# EAGLE design ACwaveformMeter (EAGLE 8.3.2)
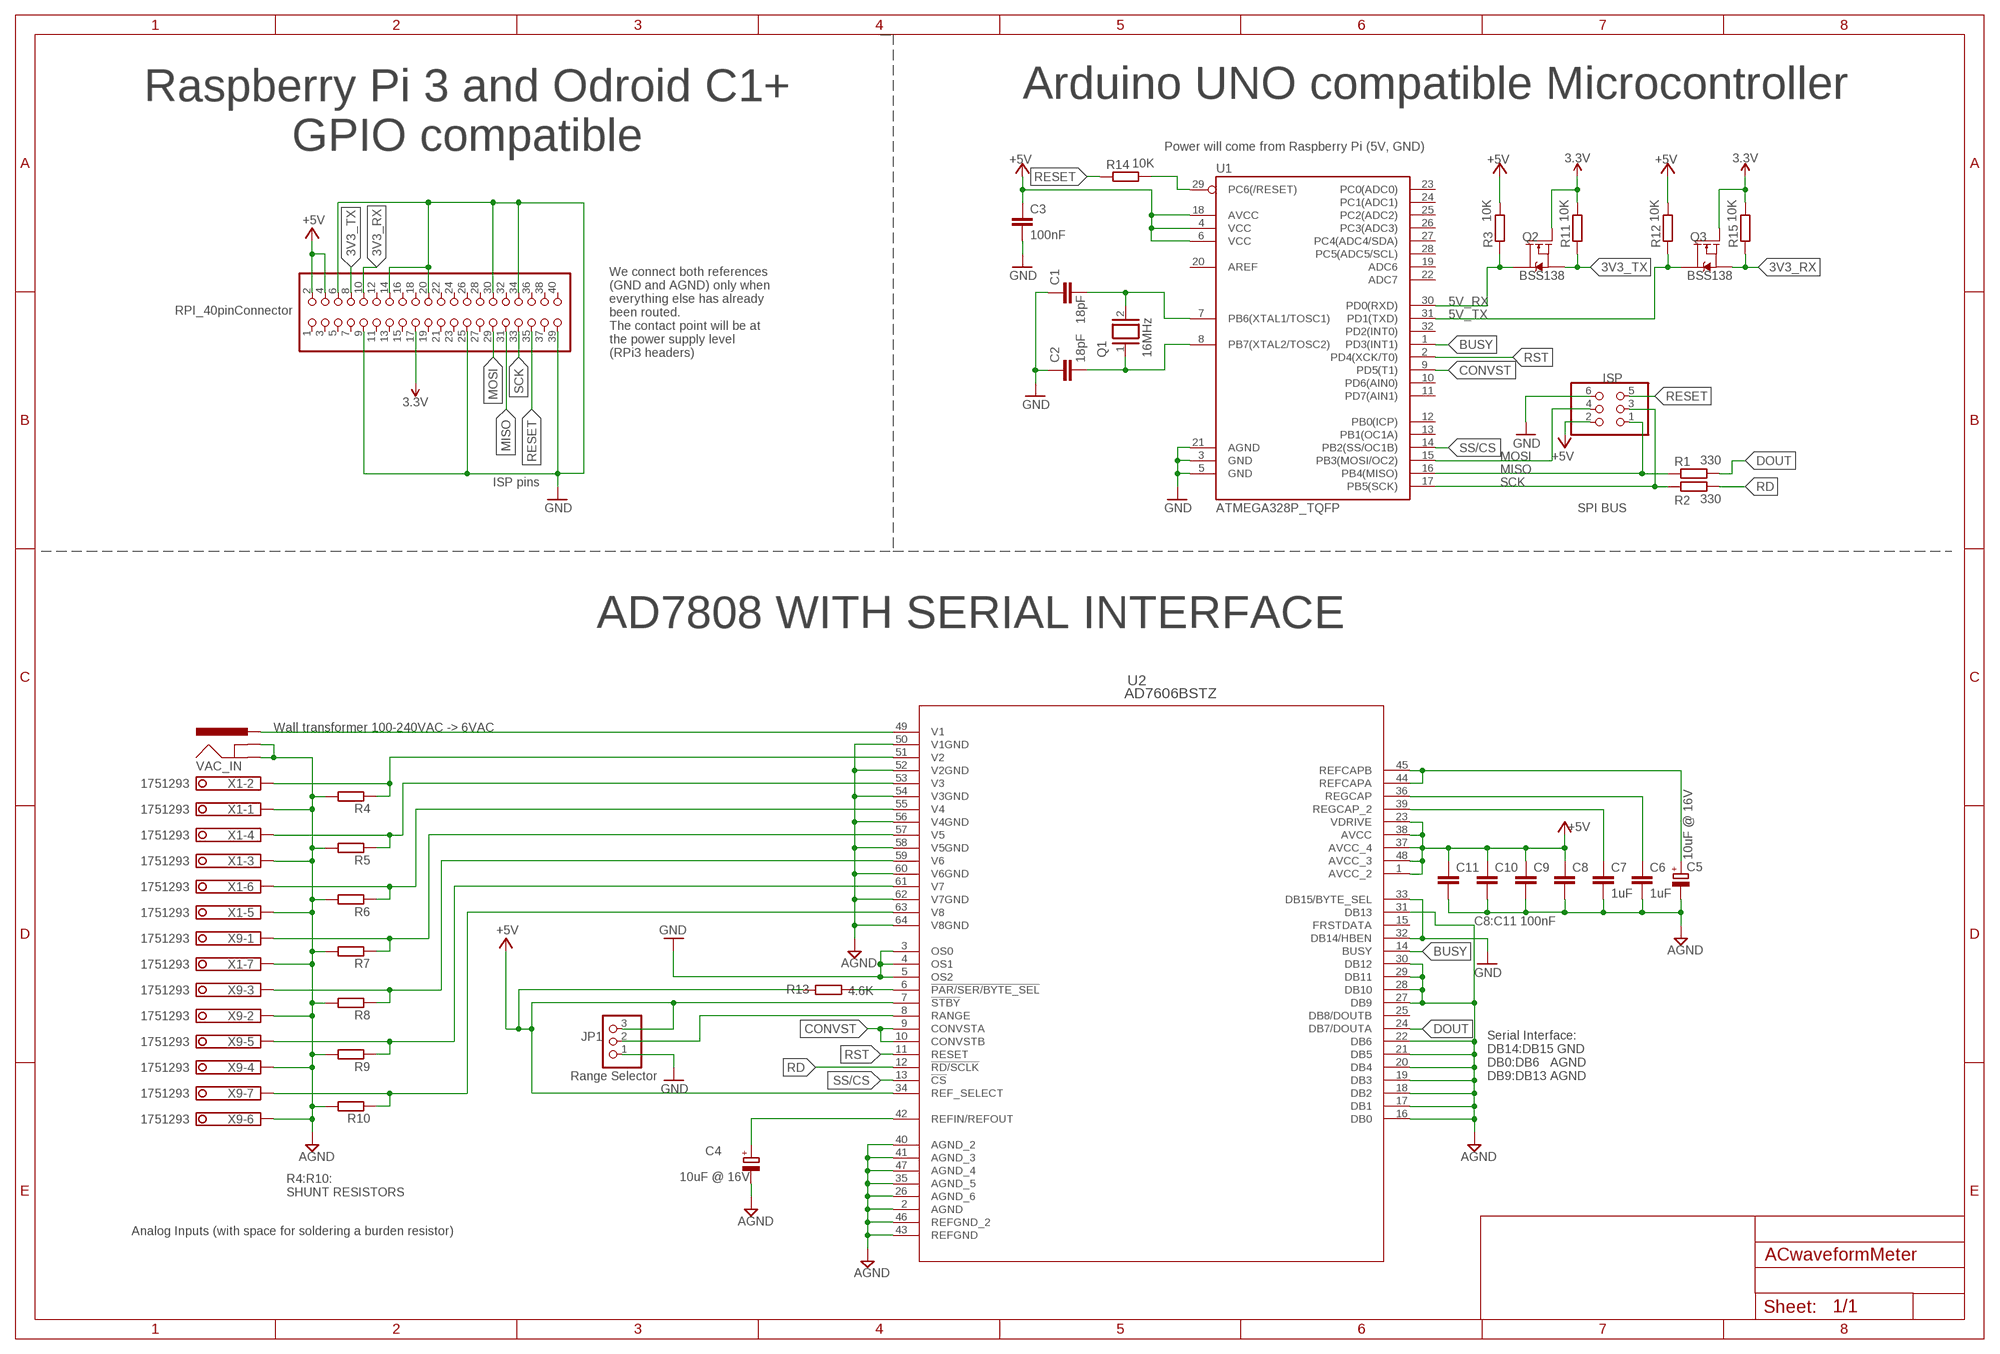
[diagram p0: schematic, sheet 1]

## Parts
C1  18pF  C-EUC0402  [C0402]
C2  18pF  C-EUC0402  [C0402]
C3  100nF  C-EUC0402  [C0402]
C4  10uF @ 16V  CPOL-EU153CLV-0405  [153CLV-0405]
C5  10uF @ 16V  CPOL-EU153CLV-0405  [153CLV-0405]
C6  1uF  C-EUC0402  [C0402]
C7  1uF  C-EUC0402  [C0402]
C8  100nF  C-EUC0402  [C0402]
C9  100nF  C-EUC0402  [C0402]
C10  100nF  C-EUC0402  [C0402]
C11  100nF  C-EUC0402  [C0402]
ISP  ISP6pin  PINHD-2X3  [2X03]
JP1  PINHD-1X3  [1X03]
Q1  16MHz  XTAL/S  [QS]
Q2  BSS138  MOSFET-NCH-BSS138  [SOT23-3]
Q3  BSS138  MOSFET-NCH-BSS138  [SOT23-3]
R1  330  R-EU_R0402  [R0402]
R2  330  R-EU_R0402  [R0402]
R3  10K  R-EU_R0402  [R0402]
R4  R-EU_M1206  [M1206]
R5  R-EU_M1206  [M1206]
R6  R-EU_M1206  [M1206]
R7  R-EU_M1206  [M1206]
R8  R-EU_M1206  [M1206]
R9  R-EU_M1206  [M1206]
R10  R-EU_M1206  [M1206]
R11  10K  R-EU_R0402  [R0402]
R12  10K  R-EU_R0402  [R0402]
R13  4.6K  R-EU_R0402  [R0402]
R14  10K  R-EU_R0402  [R0402]
R15  10K  R-EU_R0402  [R0402]
RASPBERRY_PI3  RPI_40pinConnector  PINHD-2X20  [2X20]
U1  ATMEGA328P_TQFP  [TQFP32-08]
U2  AD7606BSTZ  [ST_64_2]
VAC_IN  POWER_JACKPTH_LOCK  [POWER_JACK_PTH_LOCK]
X1  1751293  [1751293]
X9  1751293  [1751293]

## Nets
3.3V: Q2.1(G) Q3.1(G) R11.2 R15.2 RASPBERRY_PI3.17
3V3_RX: Q3.2(S) R15.1 RASPBERRY_PI3.10
3V3_TX: Q2.2(S) R11.1 RASPBERRY_PI3.8
5V_RX: Q2.3(D) R3.1 U1.30(PD0(RXD))
5V_TX: Q3.3(D) R12.1 U1.31(PD1(TXD))
+5V: C3.1 C8.1 C9.1 C10.1 C11.1 ISP.2 JP1.3 R3.2 R12.2 R13.1 RASPBERRY_PI3.2 RASPBERRY_PI3.4 U1.4(VCC) U1.6(VCC) U1.18(AVCC) U2.1(AVCC_2) U2.7(!STBY) U2.23(VDRIVE) U2.34(REF_SELECT) U2.37(AVCC_4) U2.38(AVCC) U2.48(AVCC_3)
BUSY: U1.1(PD3(INT1)) U2.14(BUSY)
CONVST: U1.9(PD5(T1)) U2.9(CONVSTA) U2.10(CONVSTB)
DOUT: R1.2 U2.24(DB7/DOUTA)
GND: C1.1 C2.1 C3.2 C4.- C5.- C6.2 C7.2 C8.2 C9.2 C10.2 C11.2 ISP.6 JP1.1 R4.2 R5.2 R6.2 R7.2 R8.2 R9.2 R10.2 RASPBERRY_PI3.6 RASPBERRY_PI3.9 RASPBERRY_PI3.14 RASPBERRY_PI3.20 RASPBERRY_PI3.25 RASPBERRY_PI3.30 RASPBERRY_PI3.34 RASPBERRY_PI3.39 U1.3(GND) U1.5(GND) U1.21(AGND) U2.2(AGND) U2.3(OS0) U2.4(OS1) U2.5(OS2) U2.16(DB0) U2.17(DB1) U2.18(DB2) U2.19(DB3) U2.20(DB4) U2.21(DB5) U2.22(DB6) U2.26(AGND_6) U2.27(DB9) U2.28(DB10) U2.29(DB11) U2.30(DB12) U2.31(DB13) U2.32(DB14/HBEN) U2.33(DB15/BYTE_SEL) U2.35(AGND_5) U2.40(AGND_2) U2.41(AGND_3) U2.43(REFGND) U2.46(REFGND_2) U2.47(AGND_4) U2.50(V1GND) U2.52(V2GND) U2.54(V3GND) U2.56(V4GND) U2.58(V5GND) U2.60(V6GND) U2.62(V7GND) U2.64(V8GND) VAC_IN.GND VAC_IN.GNDBREAK X1.1 X1.3 X1.5 X1.7 X9.2 X9.4 X9.6 ; supply symbol labelled AGND
MISO: ISP.1 R1.1 RASPBERRY_PI3.31 U1.16(PB4(MISO))
MOSI: ISP.4 RASPBERRY_PI3.29 U1.15(PB3(MOSI/OC2))
N$1: C5.+ U2.44(REFCAPA) U2.45(REFCAPB)
N$2: C4.+ U2.42(REFIN/REFOUT)
N$3: U2.49(V1) VAC_IN.PWR
N$4: C6.1 U2.36(REGCAP)
N$5: C7.1 U2.39(REGCAP_2)
N$6: C1.2 Q1.2 U1.7(PB6(XTAL1/TOSC1))
N$7: C2.2 Q1.1 U1.8(PB7(XTAL2/TOSC2))
N$8: R14.2 U1.29(PC6(/RESET))
N$9: JP1.2 U2.8(RANGE)
N$12: R13.2 U2.6(!PAR/SER/BYTE_SEL)
N$23: R4.1 U2.51(V2) X1.2
N$24: R5.1 U2.53(V3) X1.4
N$25: R6.1 U2.55(V4) X1.6
N$26: R7.1 U2.57(V5) X9.1
N$27: R8.1 U2.59(V6) X9.3
N$28: R9.1 U2.61(V7) X9.5
N$29: R10.1 U2.63(V8) X9.7
RD: R2.2 U2.12(!RD/SCLK)
RESET: ISP.5 R14.1 RASPBERRY_PI3.35
RST: U1.2(PD4(XCK/T0)) U2.11(RESET)
SCK: ISP.3 R2.1 RASPBERRY_PI3.33 U1.17(PB5(SCK))
SS/CS: U1.14(PB2(SS/OC1B)) U2.13(!CS)
Unconnected: RASPBERRY_PI3.1 RASPBERRY_PI3.3 RASPBERRY_PI3.5 RASPBERRY_PI3.7 RASPBERRY_PI3.11 RASPBERRY_PI3.12 RASPBERRY_PI3.13 RASPBERRY_PI3.15 RASPBERRY_PI3.16 RASPBERRY_PI3.18 RASPBERRY_PI3.19 RASPBERRY_PI3.21 RASPBERRY_PI3.22 RASPBERRY_PI3.23 RASPBERRY_PI3.24 RASPBERRY_PI3.26 RASPBERRY_PI3.27 RASPBERRY_PI3.28 RASPBERRY_PI3.32 RASPBERRY_PI3.36 RASPBERRY_PI3.37 RASPBERRY_PI3.38 RASPBERRY_PI3.40 U1.10(PD6(AIN0)) U1.11(PD7(AIN1)) U1.12(PB0(ICP)) U1.13(PB1(OC1A)) U1.19(ADC6) U1.20(AREF) U1.22(ADC7) U1.23(PC0(ADC0)) U1.24(PC1(ADC1)) U1.25(PC2(ADC2)) U1.26(PC3(ADC3)) U1.27(PC4(ADC4/SDA)) U1.28(PC5(ADC5/SCL)) U1.32(PD2(INT0)) U2.15(FRSTDATA) U2.25(DB8/DOUTB)

## Notes on the sheet
- Arduino UNO compatible Microcontroller
- Raspberry Pi 3 and Odroid C1+
  GPIO compatible
- Power will come from Raspberry Pi (5V, GND)
- We connect both references 
  (GND and AGND) only when 
  everything else has already 
  been routed. 
  The contact point will be at 
  the power supply level
  (RPi3 headers)
- ISP pins
- SPI BUS
- AD7808 WITH SERIAL INTERFACE
- Wall transformer 100-240VAC -> 6VAC
- C8:C11 100nF
- Range Selector
- Serial Interface: 
  DB14:DB15 GND
  DB0:DB6   AGND
  DB9:DB13 AGND
- R4:R10:
  SHUNT RESISTORS
- Analog Inputs (with space for soldering a burden resistor)

## Library data of the parts
C1-C3 C6-C11 = rcl:C-EU: CAPACITOR, European symbol
C4 C5 = rcl:CPOL-EU: POLARIZED CAPACITOR, European symbol
ISP = pinhead:PINHD-2X3: PIN HEADER
JP1 = pinhead:PINHD-1X3: PIN HEADER
Q1 = special:XTAL/S: CRYSTAL
Q2 Q3 = SparkFun-DiscreteSemi:MOSFET-NCH: N-channel MOSFETs Voltage controlled devices that allow control of high current outputs. SparkFun Products: SparkFun OpenScale <https://www.sparkfun.com/products/13261> SparkFun Digital Sandbox <https://www.sparkfun.com/products/12651> SparkFun Monster Moto Shield <https://www.sparkfun.com/products/10182> SparkFun MOSFET Power Controller <https://www.sparkfun.com/products/11214>; PROD_ID: TRANS-00830; VALUE: 220mA/50V/3.5Ω
R1-R15 = rcl:R-EU_: RESISTOR, European symbol
RASPBERRY_PI3 = pinhead:PINHD-2X20: PIN HEADER
U1 = SparkFun-IC-Microcontroller:ATMEGA328P_TQFP: Popular 328P in QFP Storefront component: ATmega328 - TQFP <https://www.sparkfun.com/products/13448> (COM-13448) Datasheet <http://www.sparkfun.com/datasheets/Components/SMD/ATMega328.pdf> SparkFun Products SparkFun RedBoard - Programmed with Arduino <https://www.sparkfun.com/products/12757> (DEV-12757) Arduino Pro Mini 328 - 5V/16MHz <https://www.sparkfun.com/products/11113> (DEV-11113) Arduino Pro Mini 328 - 3.3V/8MHz <https://www.sparkfun.com/products/11114> (DEV-11114) SparkFun OpenLog <https://www.sparkfun.com/products/13712> (DEV-13712) SparkFun MicroView - OLED Arduino Module <https://www.sparkfun.com/products/12923> (DEV-12923) SparkFun Digital Sandbox <https://www.sparkfun.com/products/12651> (DEV-12651) SparkFun PicoBoard <https://www.sparkfun.com/products/11888> (WIG-11888) Arduino Fio <https://www.sparkfun.com/products/10116> (DEV-10116) LilyPad Arduino 328 Main Board <https://www.sparkfun.com/products/13342> (DEV-13342) SparkFun RedStick <https://www.sparkfun.com/products/13741> (DEV-13741) LilyPad MP3 <https://www.sparkfun.com/products/11013> (DEV-11013) LilyPad Arduino SimpleSnap <https://www.sparkfun.com/products/10941> (DEV-10941) SparkFun Stepoko <https://www.sparkfun.com/products/13899> (ROB-13899) SparkFun Geiger Counter <https://www.sparkfun.com/products/11345> (SEN-11345) SparkFun EL Sequencer <https://www.sparkfun.com/products/12781> (COM-12781) Arduino Pro 328 - 5V/16MHz <https://www.sparkfun.com/products/10915> (DEV-10915) CryptoCape <https://www.sparkfun.com/products/12773> (DEV-12773) SparkFun IR Thermometer Evaluation Board - MLX90614 <https://www.sparkfun.com/products/10740> (SEN-10740) SparkFun RedBot Mainboard <https://www.sparkfun.com/products/12097> (ROB-12097) Arduino Pro 328 - 3.3V/8MHz <https://www.sparkfun.com/products/10914> (DEV-10914) SparkFun Block for Intel® Edison - Arduino <https://www.sparkfun.com/products/13036> (DEV-13036) SparkFun Simon Says - Surface Mount Soldering Kit <https://www.sparkfun.com/products/10935> (KIT-10935) SparkFun 7-Segment Serial Display - Red <https://www.sparkfun.com/products/11441> (COM-11441) SparkFun 7-Segment Serial Display - White <https://www.sparkfun.com/products/11629> (COM-11629) SparkFun 7-Segment Serial Display - Yellow <https://www.sparkfun.com/products/11443> (COM-11443) SparkFun 7-Segment Serial Display - Kelly Green <https://www.sparkfun.com/products/11440> (COM-11440) SparkFun 7-Segment Serial Display - Blue <https://www.sparkfun.com/products/11442> (COM-11442) SparkFun OpenSegment Serial Display - 20mm (Blue) <https://www.sparkfun.com/products/11647> (COM-11647) SparkFun OpenSegment Serial Display - 20mm (Green) <https://www.sparkfun.com/products/11646> (COM-11646) SparkFun OpenSegment Serial Display - 20mm (White) <https://www.sparkfun.com/products/11648> (COM-11648) SparkFun OpenSegment Serial Display - 20mm (Red) <https://www.sparkfun.com/products/11644> (COM-11644) SparkFun OpenSegment Serial Display - 20mm (Yellow) <https://www.sparkfun.com/products/11645> (COM-11645) SparkFun OpenSegment Shield <https://www.sparkfun.com/products/13190> (DEV-13190); PROD_ID: IC-09069
U2 = AD7606:AD7606BSTZ
VAC_IN = SparkFun-Connectors:POWER_JACK: Power Jack Connector This is the standard 5.5mm barrel jack for power. The PTH is the most common, proven, reliable, footprint. The Slot footprint only works if the mill layer is transmitted to the PCB fab house so be warned. Here are the connectors we sell at SparkFun: DC Barrel Power Jack/Connector <https://www.sparkfun.com/products/119> (PRT-00119) DC Barrel Power Jack/Connector (SMD) <https://www.sparkfun.com/products/12748> (PRT-12748) DC Barrel Jack Adapter - Breadboard Compatible <https://www.sparkfun.com/products/10811> (PRT-10811) It is used on this SparkFun product (and many, many others): SparkFun RedBoard - Programmed with Arduino <https://www.sparkfun.com/products/12757> (DEV-12757) Also, if you need a mating power supply or connector, please check these out: Wall Adapter Power Supply - 9VDC 650mA <https://www.sparkfun.com/products/298> (TOL-00298) DC Barrel Jack Adapter - Male <https://www.sparkfun.com/products/10287> (PRT-10287); PROD_ID: CONN-08197; SF_ID: PRT-00119
X1 X9 = con-phoenix-350:1751293: MKDS 1/ 7-3,5 Printklemme Nennstrom: 10 A Bemessungsspannung: 160 V Raster: 3,5 mm Polzahl: 7 Montageart: Löten Anschlussart: Schraubanschluss Anschlussrichtung vom Leiter zur Platine: 0° Source: http://eshop.phoenixcontact.com .. 1751293.pdf; OC_FARNELL: unknown; OC_NEWARK: unknown

## Board
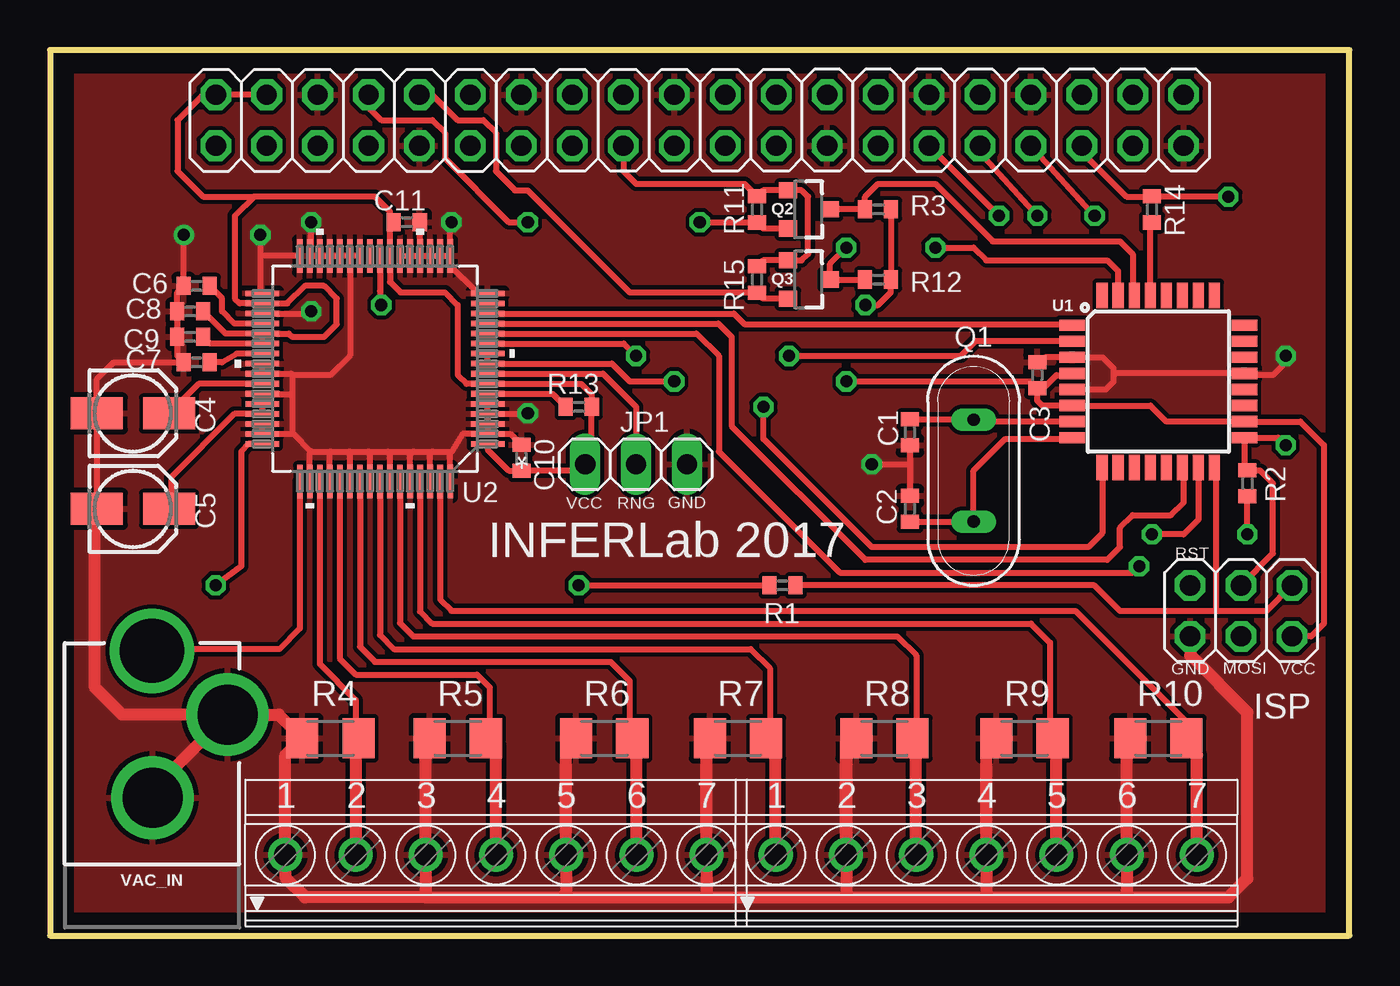
[diagram p1: board, top side]
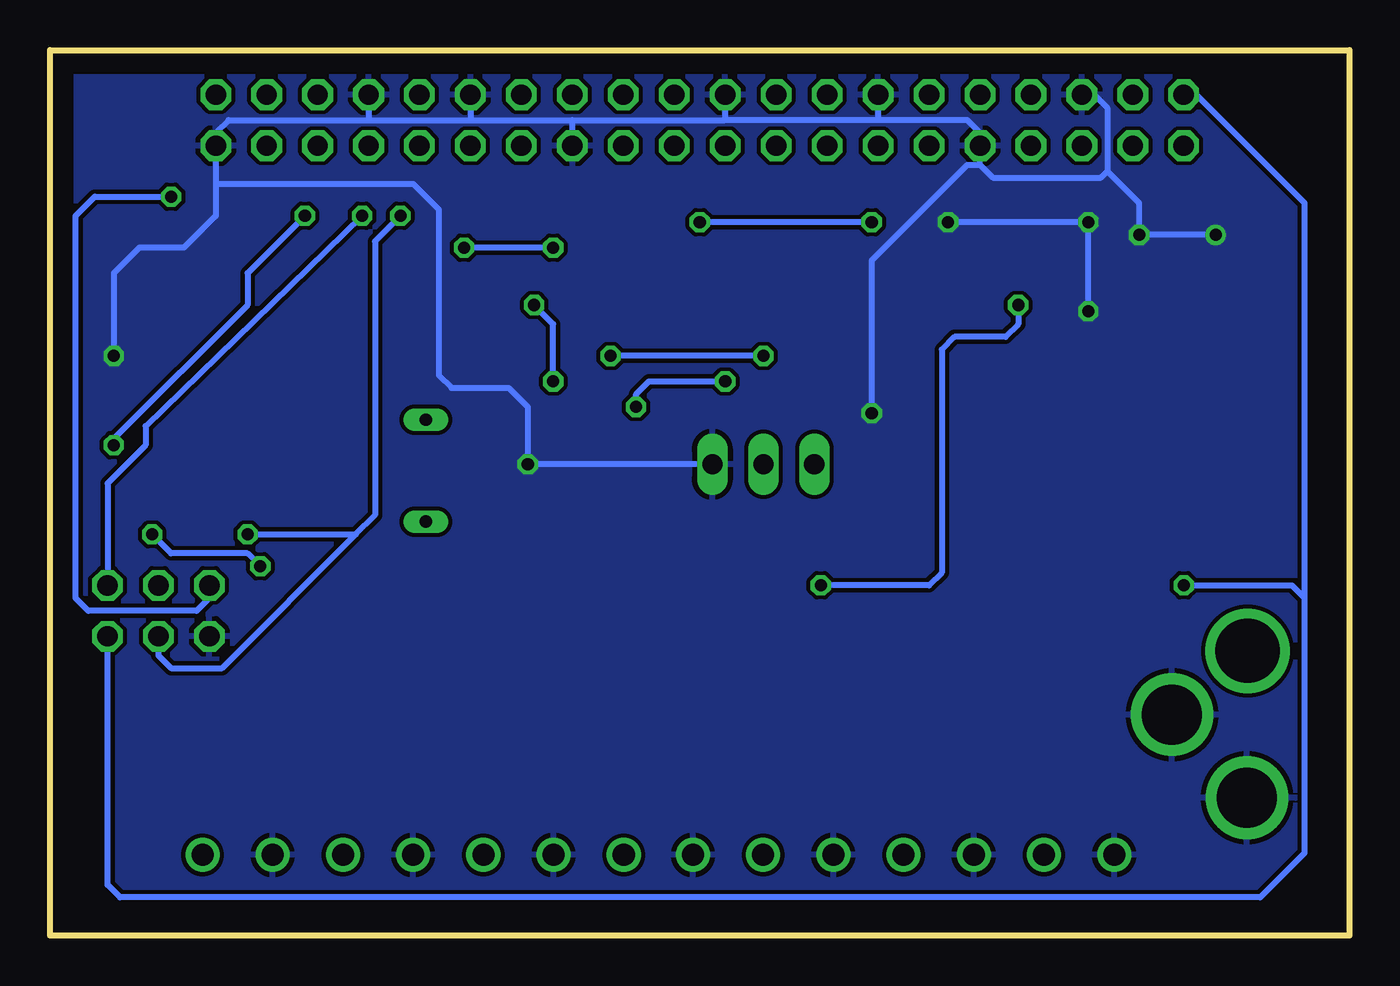
[diagram p2: board, bottom side, seen from below]

Size 64.77 x 44.13 mm. Coordinates in mm from the lower left corner, seen from the top.
Outline: 0,0 64.77,0 64.77,44.13 0,44.13 0,0
Copper layers (1*16): Top 0.035mm / dielectric 1.5mm / Bottom 0.035mm
Design rules "default *": minimum track width 10mil, minimum drill 24mil, track to track 8mil, track to pad 15mil, pad to pad 8mil, via to via 8mil, smd to smd 8mil, copper to edge 40mil, drill to drill 8mil, minimum pad ring 10mil, minimum via ring 8mil, stop-mask expansion 4mil, vias tented up to drill 0mil, thermal gap 10mil

### Footprints (pad centres in the part's own frame; a part is rotated, then mirrored left to right if it is on the bottom)
C0402 = smd 0.7 x 0.9: 1 -0.65,0; 2 0.65,0
153CLV-0405 = smd 2.6 x 1.6: + 1.8,0; - -1.8,0
2X03 = drill 1.016 octagon: 1 -2.54,-1.27; 2 -2.54,1.27; 3 0,-1.27; 4 0,1.27; 5 2.54,-1.27; 6 2.54,1.27
1X03 = drill 1.016 long: 1 -2.54,0; 2 0,0; 3 2.54,0
QS = drill 0.61 long: 1 -2.54,0; 2 2.54,0
SOT23-3 = smd 0.8 x 0.9: 1 -0.95,-1; 2 0.95,-1; 3 0,1.1
R0402 = smd 0.7 x 0.9: 1 -0.65,0; 2 0.65,0
M1206 = smd 1.6 x 2: 1 -1.4,0; 2 1.4,0
2X20 = drill 1.016 octagon: 1 -24.13,-1.27; 2 -24.13,1.27; 3 -21.59,-1.27; 4 -21.59,1.27; 5 -19.05,-1.27; 6 -19.05,1.27; 7 -16.51,-1.27; 8 -16.51,1.27; 9 -13.97,-1.27; 10 -13.97,1.27; 11 -11.43,-1.27; 12 -11.43,1.27; 13 -8.89,-1.27; 14 -8.89,1.27; 15 -6.35,-1.27; 16 -6.35,1.27; 17 -3.81,-1.27; 18 -3.81,1.27; 19 -1.27,-1.27; 20 -1.27,1.27; 21 1.27,-1.27; 22 1.27,1.27; 23 3.81,-1.27; 24 3.81,1.27; 25 6.35,-1.27; 26 6.35,1.27; 27 8.89,-1.27; 28 8.89,1.27; 29 11.43,-1.27; 30 11.43,1.27; 31 13.97,-1.27; 32 13.97,1.27; 33 16.51,-1.27; 34 16.51,1.27; 35 19.05,-1.27; 36 19.05,1.27; 37 21.59,-1.27; 38 21.59,1.27; 39 24.13,-1.27; 40 24.13,1.27
TQFP32-08 = smd 1.27 x 0.559: 1 -4.293,2.8; 2 -4.293,2; 3 -4.293,1.2; 4 -4.293,0.4; 5 -4.293,-0.4; 6 -4.293,-1.2; 7 -4.293,-2; 8 -4.293,-2.8; 17 4.293,-2.8; 18 4.293,-2; 19 4.293,-1.2; 20 4.293,-0.4; 21 4.293,0.4; 22 4.293,1.2; 23 4.293,2; 24 4.293,2.8 | smd 0.559 x 1.27: 9 -2.8,-4.293; 10 -2,-4.293; 11 -1.2,-4.293; 12 -0.4,-4.293; 13 0.4,-4.293; 14 1.2,-4.293; 15 2,-4.293; 16 2.8,-4.293; 25 2.8,4.293; 26 2,4.293; 27 1.2,4.293; 28 0.4,4.293; 29 -0.4,4.293; 30 -1.2,4.293; 31 -2,4.293; 32 -2.8,4.293
ST_64_2 = smd 1.664 x 0.279: 1 -5.62,3.75; 2 -5.62,3.25; 3 -5.62,2.75; 4 -5.62,2.25; 5 -5.62,1.75; 6 -5.62,1.25; 7 -5.62,0.75; 8 -5.62,0.25; 9 -5.62,-0.25; 10 -5.62,-0.75; 11 -5.62,-1.25; 12 -5.62,-1.75; 13 -5.62,-2.25; 14 -5.62,-2.75; 15 -5.62,-3.25; 16 -5.62,-3.75; 33 5.62,-3.75; 34 5.62,-3.25; 35 5.62,-2.75; 36 5.62,-2.25; 37 5.62,-1.75; 38 5.62,-1.25; 39 5.62,-0.75; 40 5.62,-0.25; 41 5.62,0.25; 42 5.62,0.75; 43 5.62,1.25; 44 5.62,1.75; 45 5.62,2.25; 46 5.62,2.75; 47 5.62,3.25; 48 5.62,3.75 | smd 0.279 x 1.664: 17 -3.75,-5.62; 18 -3.25,-5.62; 19 -2.75,-5.62; 20 -2.25,-5.62; 21 -1.75,-5.62; 22 -1.25,-5.62; 23 -0.75,-5.62; 24 -0.25,-5.62; 25 0.25,-5.62; 26 0.75,-5.62; 27 1.25,-5.62; 28 1.75,-5.62; 29 2.25,-5.62; 30 2.75,-5.62; 31 3.25,-5.62; 32 3.75,-5.62; 49 3.75,5.62; 50 3.25,5.62; 51 2.75,5.62; 52 2.25,5.62; 53 1.75,5.62; 54 1.25,5.62; 55 0.75,5.62; 56 0.25,5.62; 57 -0.25,5.62; 58 -0.75,5.62; 59 -1.25,5.62; 60 -1.75,5.62; 61 -2.25,5.62; 62 -2.75,5.62; 63 -3.25,5.62; 64 -3.75,5.62
POWER_JACK_PTH_LOCK = drill 2.997 pad 4.115: GND 0.025,6.557; GNDBREAK 3.762,10.7 | drill 3.2 pad 4.115: PWR 0,13.878
1751293 = drill 1.1 pad 1.7: 1 -10.5,-0.1; 2 -7,-0.1; 3 -3.5,-0.1; 4 0,-0.1; 5 3.5,-0.1; 6 7,-0.1; 7 10.5,-0.1

### Placement (x,y rotation side)
C1  42.86,25.08 90 top
C2  42.86,21.27 270 top
C3  49.21,27.94 90 top
C4  4.13,26.04 0 top
C5  4.13,21.27 0 top
C6  7.3,32.38 180 top
C7  7.3,28.57 180 top
C8  6.99,31.11 180 top
C9  6.99,29.84 180 top
C10  23.5,23.81 90 top
C11  17.78,35.56 0 top
ISP  59.37,16.19 180 top
JP1  29.21,23.5 180 top
Q1  46.04,23.18 90 top
Q2  37.78,36.2 270 top
Q3  37.78,32.7 270 top
R1  36.51,17.46 180 top
R2  59.69,22.54 270 top
R3  41.27,36.2 0 top
R4  13.97,9.84 180 top
R5  20.32,9.84 180 top
R6  27.62,9.84 180 top
R7  34.29,9.84 180 top
R8  41.59,9.84 180 top
R9  48.58,9.84 180 top
R10  55.24,9.84 180 top
R11  35.24,36.2 90 top
R12  41.27,32.7 0 top
R13  26.35,26.35 180 top
R14  54.93,36.2 270 top
R15  35.24,32.7 90 top
RASPBERRY_PI3  32.38,40.64 0 top
U1  55.24,27.62 0 top
U2  16.19,28.26 180 top
VAC_IN  5.08,0.32 0 top
X1  22.23,4.13 0 top
X9  46.67,4.13 0 top

### Tracks (layer width: path | path; a pad name or v marks a point on that pad's centre or on a via)
3.3V
  Top 0.305: RASPBERRY_PI3.17 28.57,38.1 29.21,37.47 34.62,37.47 R11.2 35.54,37.15 Q2.1 37.47,37.15 37.78,36.83 37.78,33.97 37.46,33.65 Q3.1 35.54,33.65 R15.2
3V3_RX
  Top 0.305: RASPBERRY_PI3.10 19.05,41.91 20.32,40.64 21.59,40.64 22.23,40.01 22.23,38.1 23.18,37.15 23.81,37.15 28.89,32.07 35.23,32.07 R15.1 35.54,31.75 Q3.2
3V3_TX  (via drill 0.6)
  Top 0.305: RASPBERRY_PI3.8 15.88,41.27 16.51,40.64 19.05,40.64 19.68,40.01 19.68,38.73 22.86,35.56 v23.81,35.56 | Q2.2 35.54,35.24 R11.1 35.23,35.56 v32.38,35.56
  Bottom 0.305: v23.81,35.56 v32.38,35.56
5V_RX
  Top 0.305: Q2.3 R3.1 40.62,36.81 41.27,37.47 44.13,37.47 46.99,34.61 53.34,34.61 53.98,33.97 53.98,31.98 U1.30
5V_TX  (via drill 0.6)
  Top 0.305: R12.1 Q3.3 38.88,33.48 v39.69,34.29 | v44.13,34.29 46.04,34.29 46.67,33.66 52.7,33.66 53.24,33.12 U1.31
  Bottom 0.305: v39.69,34.29 v44.13,34.29
+5V  (via drill 0.6)
  Top 0.305: U2.48 9.9,24.51 9.53,24.13 9.53,18.41 v8.26,17.46 | U2.23 16.94,32.59 17.46,32.07 19.68,32.07 20.32,31.43 20.32,27.94 20.75,27.51 U2.7 26.47,27.51 26.99,26.99 26.99,26.37 R13.1 26.99,26.34 26.99,23.81 JP1.3 26.35,23.18 23.51,23.18 C10.1 23.48,23.18 22.86,23.18 21.81,24.23 U2.1 | U2.37 11.9,30.01 12.06,29.84 13.65,29.84 14.29,30.48 14.29,31.75 13.65,32.38 12.7,32.38 11.82,31.51 U2.34 9.45,31.51 9.21,31.75 9.21,35.88 10.16,36.83 | U2.23 16.94,35.37 C11.1 | U2.23 16.94,36.08 16.19,36.83 10.16,36.83 | C9.1 7.97,29.51 U2.38 U2.37 | U2.37 8.74,30.01 C8.1 | 10.16,36.83 7.62,36.83 6.35,38.1 6.35,40.64 7.62,41.91 RASPBERRY_PI3.2 RASPBERRY_PI3.4 | R3.2 R12.2 | v39.69,27.62 48.88,27.62 C3.1 | C3.1 49.21,26.67 49.46,26.42 U1.6 54.86,26.42 55.66,25.62 U1.18 62.33,25.62 63.5,24.45 63.5,15.56 62.87,14.92 ISP.2 | C3.1 49.52,27.29 50.16,27.94 50.87,27.94 U1.4 | v40.64,31.43 41.27,31.43 41.91,32.07 41.91,32.69 R12.2 | R12.2
  Bottom 0.305: ISP.2 61.91,2.54 61.28,1.91 4.45,1.91 2.22,4.13 2.22,16.83 | 2.22,16.83 2.22,36.51 7.62,41.91 RASPBERRY_PI3.2 | v8.26,17.46 2.86,17.46 2.22,16.83 | v39.69,27.62 39.69,30.48 v40.64,31.43
BUSY
  Top 0.305: U2.14 34.08,31.01 34.61,30.48 50.9,30.48 U1.1
CONVST  (via drill 0.6)
  Top 0.305: U2.10 U2.9 28.01,28.51 28.89,27.62 v31.11,27.62 | U1.9 52.45,20.06 51.75,19.37 40.96,19.37 35.56,24.77 v35.56,26.35
  Bottom 0.305: v35.56,26.35 35.56,26.99 34.92,27.62 v31.11,27.62
DOUT  (via drill 0.6)
  Top 0.305: U2.24 16.44,32.13 v16.51,31.43 | v26.35,17.46 R1.2
  Bottom 0.305: v16.51,31.43 16.51,30.48 17.14,29.84 19.68,29.84 20.32,29.21 20.32,18.1 20.95,17.46 v26.35,17.46
GND  (via drill 0.6)
  Top 0.305: U2.4 U2.3 U2.2 | 10.48,33.97 10.48,32.1 U2.33 | U2.32 10.57,33.88 10.48,33.97 | v10.48,34.92 10.48,33.97 | U2.4 23.79,26.01 v23.81,26.04 | U2.4 U2.5 | U2.43 10.59,26.99 12.06,26.99 | 15.44,33.86 U2.26 U2.27 | U2.31 U2.30 U2.29 | U2.29 U2.28 U2.27 | U2.22 U2.21 U2.20 | U2.20 U2.19 U2.18 U2.17 | U2.17 19.94,33.4 21.27,32.07 21.75,32.07 U2.16 | U2.40 U2.41 12,28.01 12.06,27.94 | U2.2 20.56,25.01 20,24.13 | 12.14,25.01 U2.47 U2.46 | 12.06,27.94 12.06,26.99 | 13.02,24.13 13.97,24.13 | 13.97,24.13 14.92,24.13 | 14.92,24.13 15.88,24.13 | 15.88,24.13 16.83,24.13 | 16.83,24.13 18.1,24.13 | 18.1,24.13 19.05,24.13 | 19.05,24.13 20,24.13 | 12.06,26.99 12.06,25.08 12.14,25.01 | 12.14,25.01 13.02,24.13 | U2.50 12.94,24.05 13.02,24.13 | U2.52 13.94,24.1 13.97,24.13 | 14.94,23.83 U2.54 14.94,24.11 14.92,24.13 | U2.56 15.94,24.06 15.88,24.13 | 20,24.13 19.94,24.07 U2.64 | U2.62 18.94,24.02 19.05,24.13 | U2.58 16.94,24.02 16.83,24.13 | U2.60 17.94,23.98 18.1,24.13 | U2.27 U2.29 | U2.29 13.11,33.88 13.02,33.97 v13.02,35.56 | 13.97,33.85 U2.29 | U2.27 14.94,28.91 13.97,27.94 12.06,27.94 | U2.35 12.91,31.01 v13.02,31.11 | U2.17 19.94,35.5 v20,35.56 | U2.20 18.44,35.55 C11.2 | U2.2 22.95,25.01 C10.2 | C5.- C4.- 2.33,27.73 3.17,28.57 C7.2 6.33,28.89 C9.2 C8.2 6.33,32.07 C6.2 6.65,34.91 v6.67,34.92 | C3.2 49.62,28.82 U1.3 52.46,28.82 53.02,28.26 53.02,27.94 | C1.1 42.86,23.5 | 42.86,23.5 C2.1 | v40.96,23.5 42.86,23.5 | U1.5 52.62,27.22 53.02,27.62 53.02,27.94 | 53.02,27.94 53.1,28.02 U1.21 59.62,27.94 60.96,27.94 61.59,28.57 v61.59,28.89
  Top 0.61: 18.73,1.91 25.4,1.91 | 25.4,1.91 32.7,1.91 | 32.7,1.91 39.69,1.91 | 39.69,1.91 46.67,1.91 | 46.67,1.91 53.66,1.91 | 53.66,1.91 53.67,2.24 X9.6 53.67,9.67 R10.2 | X9.2 39.67,9.64 R8.2 39.69,9.84 39.69,1.91 | R9.2 46.67,9.34 X9.4 46.67,1.91 | 32.7,1.91 32.73,1.93 X1.7 32.73,9.68 R7.2 | 25.4,1.91 25.73,1.91 X1.5 25.73,9.35 R6.2 | 18.73,1.91 X1.3 18.73,9.65 R5.2 | 18.73,1.91 12.7,1.91 11.75,2.86 11.75,4 X1.1 11.72,9 R4.2 11.39,11.02 VAC_IN.GNDBREAK | VAC_IN.GND 5.11,7.28 VAC_IN.GNDBREAK | VAC_IN.GNDBREAK 3.59,11.02 2.22,12.38 2.22,21.17 C5.- | 53.66,1.91 58.74,1.91 59.69,2.86 59.69,11.11 56.83,13.97 ISP.6
  Bottom 0.305: 12.06,38.1 12.06,41.27 12.7,41.91 RASPBERRY_PI3.6 | 12.06,38.1 10.48,36.51 v10.48,34.92 v6.67,34.92 | 18.41,38.42 17.78,37.78 12.38,37.78 12.06,38.1 | 18.41,38.42 19.05,38.42 23.81,33.66 v23.81,26.04 | 18.41,38.42 RASPBERRY_PI3.9 18.41,40.01 19.05,40.64 23.5,40.64 | v20,35.56 v13.02,35.56 v13.02,31.11 | 23.5,40.64 31.11,40.64 | 48.9,40.64 43.81,40.64 | 43.81,40.64 38.73,40.64 | 38.73,40.64 31.11,40.64 | RASPBERRY_PI3.34 48.9,40.64 | RASPBERRY_PI3.30 43.81,40.64 | RASPBERRY_PI3.20 31.11,40.64 | RASPBERRY_PI3.25 38.73,40.64 | 48.9,40.64 55.88,40.64 56.52,40.01 RASPBERRY_PI3.39 56.52,37.47 | 56.52,37.47 46.67,37.47 45.4,36.2 45.4,27.94 44.77,27.3 41.91,27.3 40.96,26.35 v40.96,23.5 JP1.1 | RASPBERRY_PI3.14 23.5,40.64 | 56.52,37.47 56.52,35.88 58.1,34.29 60.33,34.29 61.59,33.02 v61.59,28.89
  pour Top: 0,44.13 0,0 64.77,0 64.77,5.08 64.77,44.13
  pour Bottom: 0,44.13 64.77,44.13 64.77,0 0,0
MISO  (via drill 0.6)
  Top 0.305: R1.1 52.07,17.46 53.34,16.19 58.1,16.19 | RASPBERRY_PI3.31 46.35,39.05 v49.21,35.88 | 58.1,16.19 60.64,16.19 ISP.1 | 58.1,16.19 58.1,23.27 U1.16
  Bottom 0.305: v49.21,35.88 60.01,25.4 60.01,24.45 61.91,22.54 ISP.1
MOSI  (via drill 0.6)
  Top 0.305: RASPBERRY_PI3.29 43.81,39.05 44.13,39.05 v47.31,35.88 | U1.15 57.24,20.73 56.52,20 v54.93,20
  Bottom 0.305: v47.31,35.88 48.58,34.61 48.58,20.95 49.53,20 | ISP.4 59.37,13.97 58.74,13.34 56.2,13.34 49.53,20 | v54.93,20 49.53,20
N$1
  Top 0.305: U2.44 U2.45 9.18,26.01 6.03,22.86 6.03,21.38 C5.+
N$2
  Top 0.305: U2.42 7.4,27.51 C4.+
N$3
  Top 0.305: U2.49 12.44,15.3 11.43,14.29 5.17,14.29 VAC_IN.PWR
N$4
  Top 0.305: U2.36 9.18,30.51 8.57,31.11 8.57,31.77 C6.1
N$5
  Top 0.305: U2.39 9.32,29.01 8.57,28.57 C7.1
N$6
  Top 0.305: C1.2 45.7,25.73 Q1.2 47.09,25.62 U1.7
N$7
  Top 0.305: C2.2 45.7,20.62 Q1.1 46.04,23.18 47.62,24.77 50.9,24.77 U1.8
N$8
  Top 0.305: U1.29 54.84,35.46 R14.2
N$9
  Top 0.305: JP1.2 29.21,26.35 27.55,28.01 U2.8
N$12
  Top 0.305: U2.6 25.05,27.01 R13.2
N$23
  Top 0.305: U2.51 13.44,13.54 15.24,11.75 15.24,9.97 R4.1
  Top 0.61: R4.1 15.24,9.84 15.24,4.04 X1.2
N$24
  Top 0.305: U2.53 14.44,13.81 15.24,13.02 21.27,13.02 21.91,12.38 21.91,10.03 R5.1
  Top 0.61: R5.1 22.23,9.53 X1.4
N$25
  Top 0.305: U2.55 15.44,14.4 16.19,13.65 27.94,13.65 28.89,12.7 28.89,9.97 R6.1 28.89,10.66
  Top 0.61: R6.1 29.23,9.64 X1.6
N$26
  Top 0.305: U2.57 16.44,14.99 17.14,14.29 34.92,14.29 35.88,13.34 35.88,10.79 36.2,10.48 36.2,10.35 R7.1
  Top 0.61: X9.1 36.17,9.36 R7.1
N$27
  Top 0.305: R8.1 43.18,10.66 43.18,13.97 42.23,14.92 18.1,14.92 17.44,15.58 U2.59
  Top 0.61: X9.3 43.17,9.35 R8.1
N$28
  Top 0.305: R9.1 49.85,10.66 49.85,14.61 48.9,15.56 19.05,15.56 18.44,16.16 U2.61
  Top 0.61: X9.5 50.17,9.65 R9.1
N$29
  Top 0.305: R10.1 56.96,10.16 57.15,10.16 51.12,16.19 20,16.19 19.44,16.75 U2.63
  Top 0.61: X9.7 57.17,9 R10.1
RD  (via drill 0.6)
  Top 0.305: U2.12 32.22,30.01 33.34,28.89 33.34,24.13 39.37,18.1 53.98,18.1 v54.29,18.41 | v59.69,20 R2.2
  Bottom 0.305: v54.29,18.41 54.93,19.05 58.74,19.05 v59.69,20
RESET  (via drill 0.6)
  Top 0.305: RASPBERRY_PI3.35 51.44,39.05 53.66,36.83 54.91,36.83 R14.1 54.94,36.83 v58.74,36.83
  Bottom 0.305: ISP.5 56.83,16.83 57.47,16.19 62.87,16.19 63.5,16.83 63.5,35.88 62.55,36.83 v58.74,36.83
RST  (via drill 0.6)
  Top 0.305: U2.11 28.59,29.51 v29.21,28.89 | U1.2 46.13,29.62 45.4,28.89 v36.83,28.89
  Bottom 0.305: v29.21,28.89 v36.83,28.89
SCK  (via drill 0.6)
  Top 0.305: RASPBERRY_PI3.33 v52.07,35.88 | v61.59,24.45 61.22,24.82 U1.17 59.54,23.34 R2.1 59.7,23.18 60.33,23.18 60.96,22.54 60.96,19.05 ISP.3
  Bottom 0.305: v61.59,24.45 61.59,24.77 54.93,31.43 54.93,33.02 v52.07,35.88
SS/CS
  Top 0.305: U2.13 33.31,30.51 33.97,29.84 33.97,25.4 40.64,18.73 52.7,18.73 53.34,19.37 53.34,20.32 53.98,20.95 55.88,20.95 56.52,21.59 56.52,23.26 U1.14

### Text on the board
tNames: GND | VCC | RNG | INFERLab 2017 | RST | MOSI | GND | VCC